# EAGLE schematic common emitter_se-piccolo segnale (EAGLE 9.6.2)
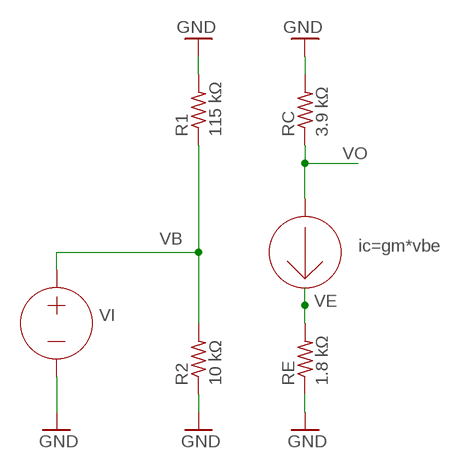
[diagram p0: schematic, sheet 1]

## Parts
I1  ic=gm*vbe  CURRENT  (no package)
R1  115 kΩ  R-US_0204/5  [0204/5]
R2  10 kΩ  R-US_0204/5  [0204/5]
RC  3.9 kΩ  R-US_0204/5  [0204/5]
RE  1.8 kΩ  R-US_0204/5  [0204/5]
VI  0V  VOLTAGE  (no package)

## Nets
GND: R1.2 R2.1 RC.2 RE.1 VI.-
VB: R1.1 R2.2 VI.+
VE: I1.- RE.2
VO: I1.+ RC.1

## Library data of the parts
I1 = ngspice-simulation:CURRENT: Independent Current Source; VALUE: 0A
R1 R2 RC RE = rcl:R-US_: RESISTOR, American symbol; SPICEPREFIX: R
VI = ngspice-simulation:VOLTAGE: Independent Voltage Source, either DC, AC, PULSE, SINE, PWL, EXP, or SFFM